# Altium project PT-15-V1.0.PrjPcb (part 1 of 7)
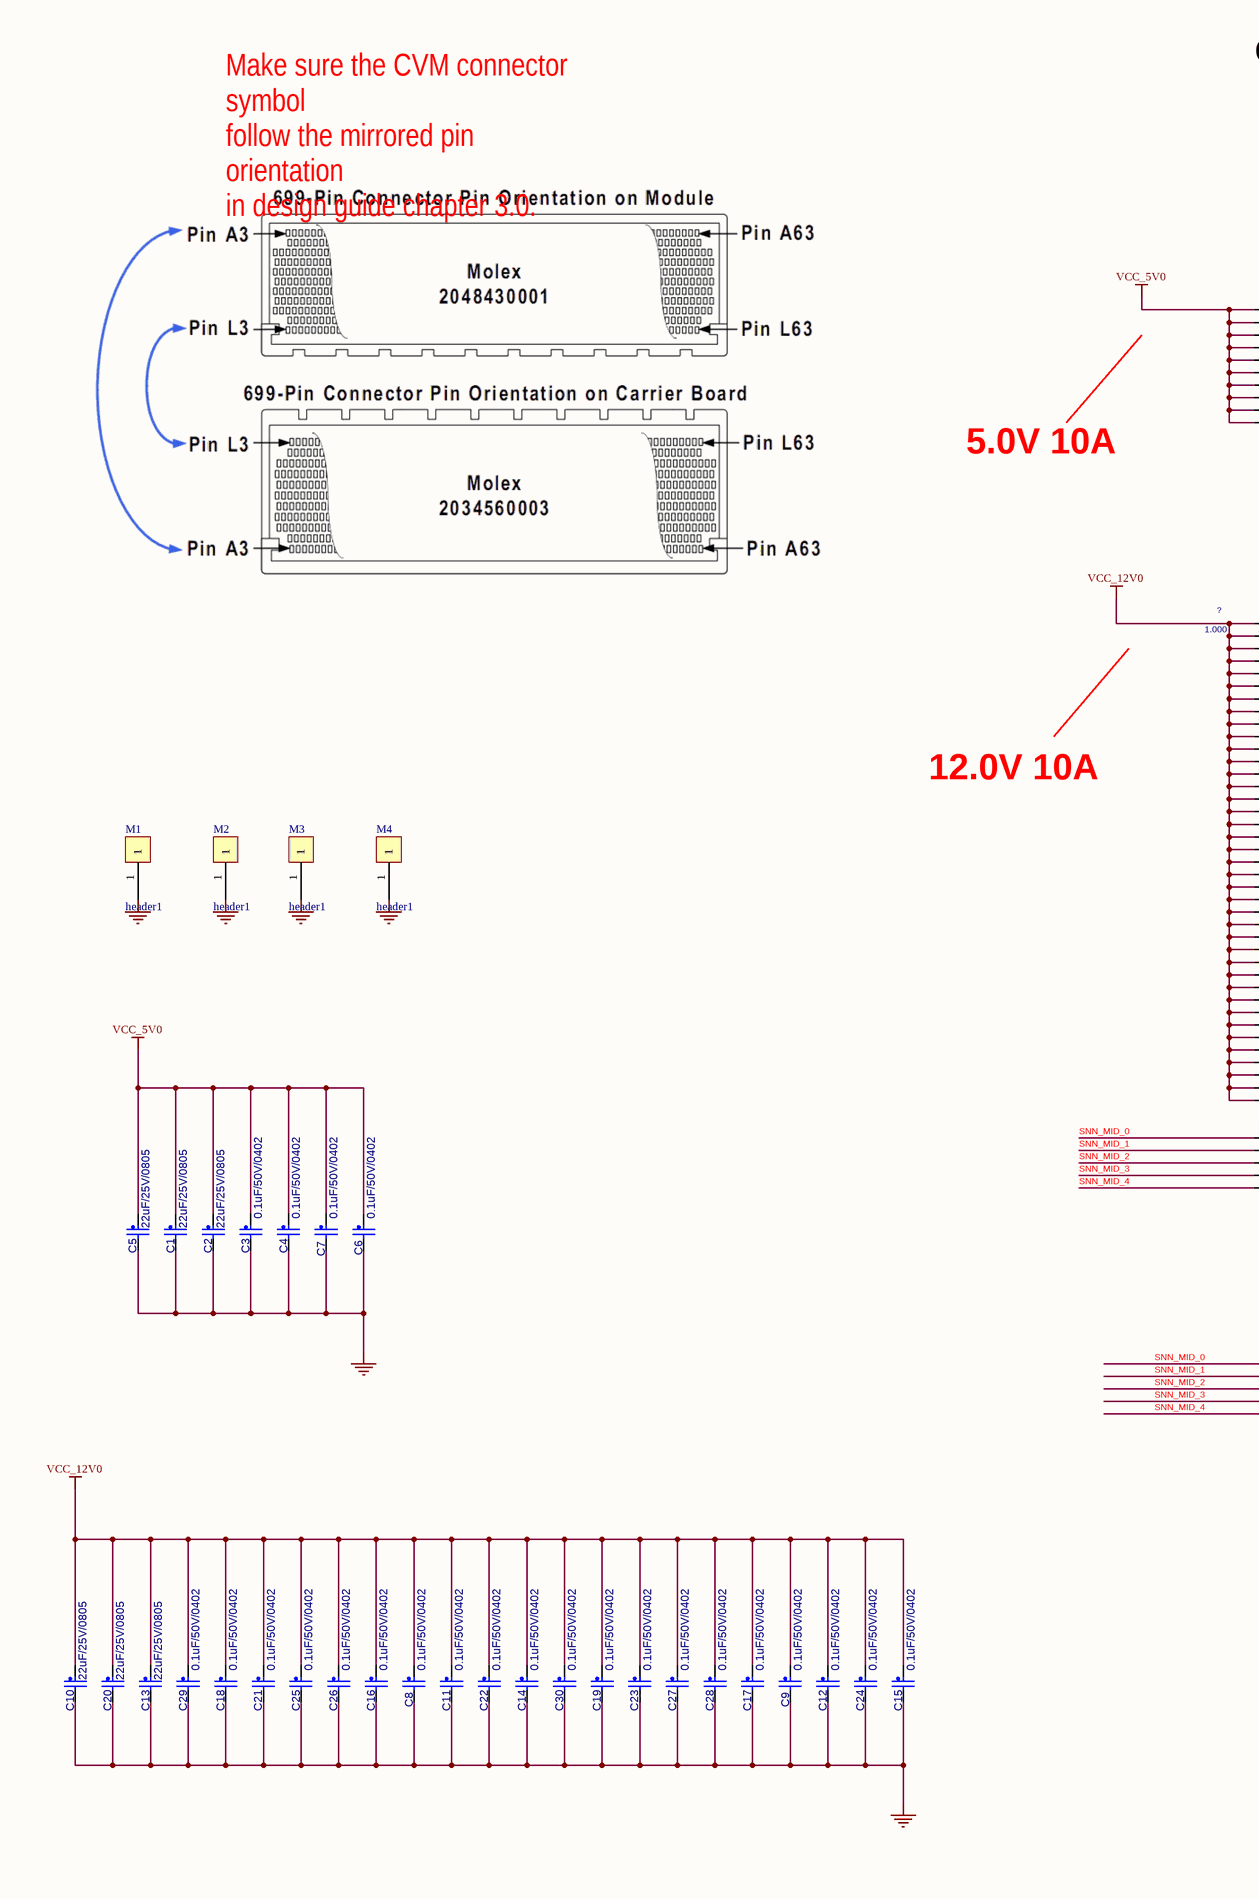
[diagram p0: 01-ORIN_PWR.SchDoc, left]
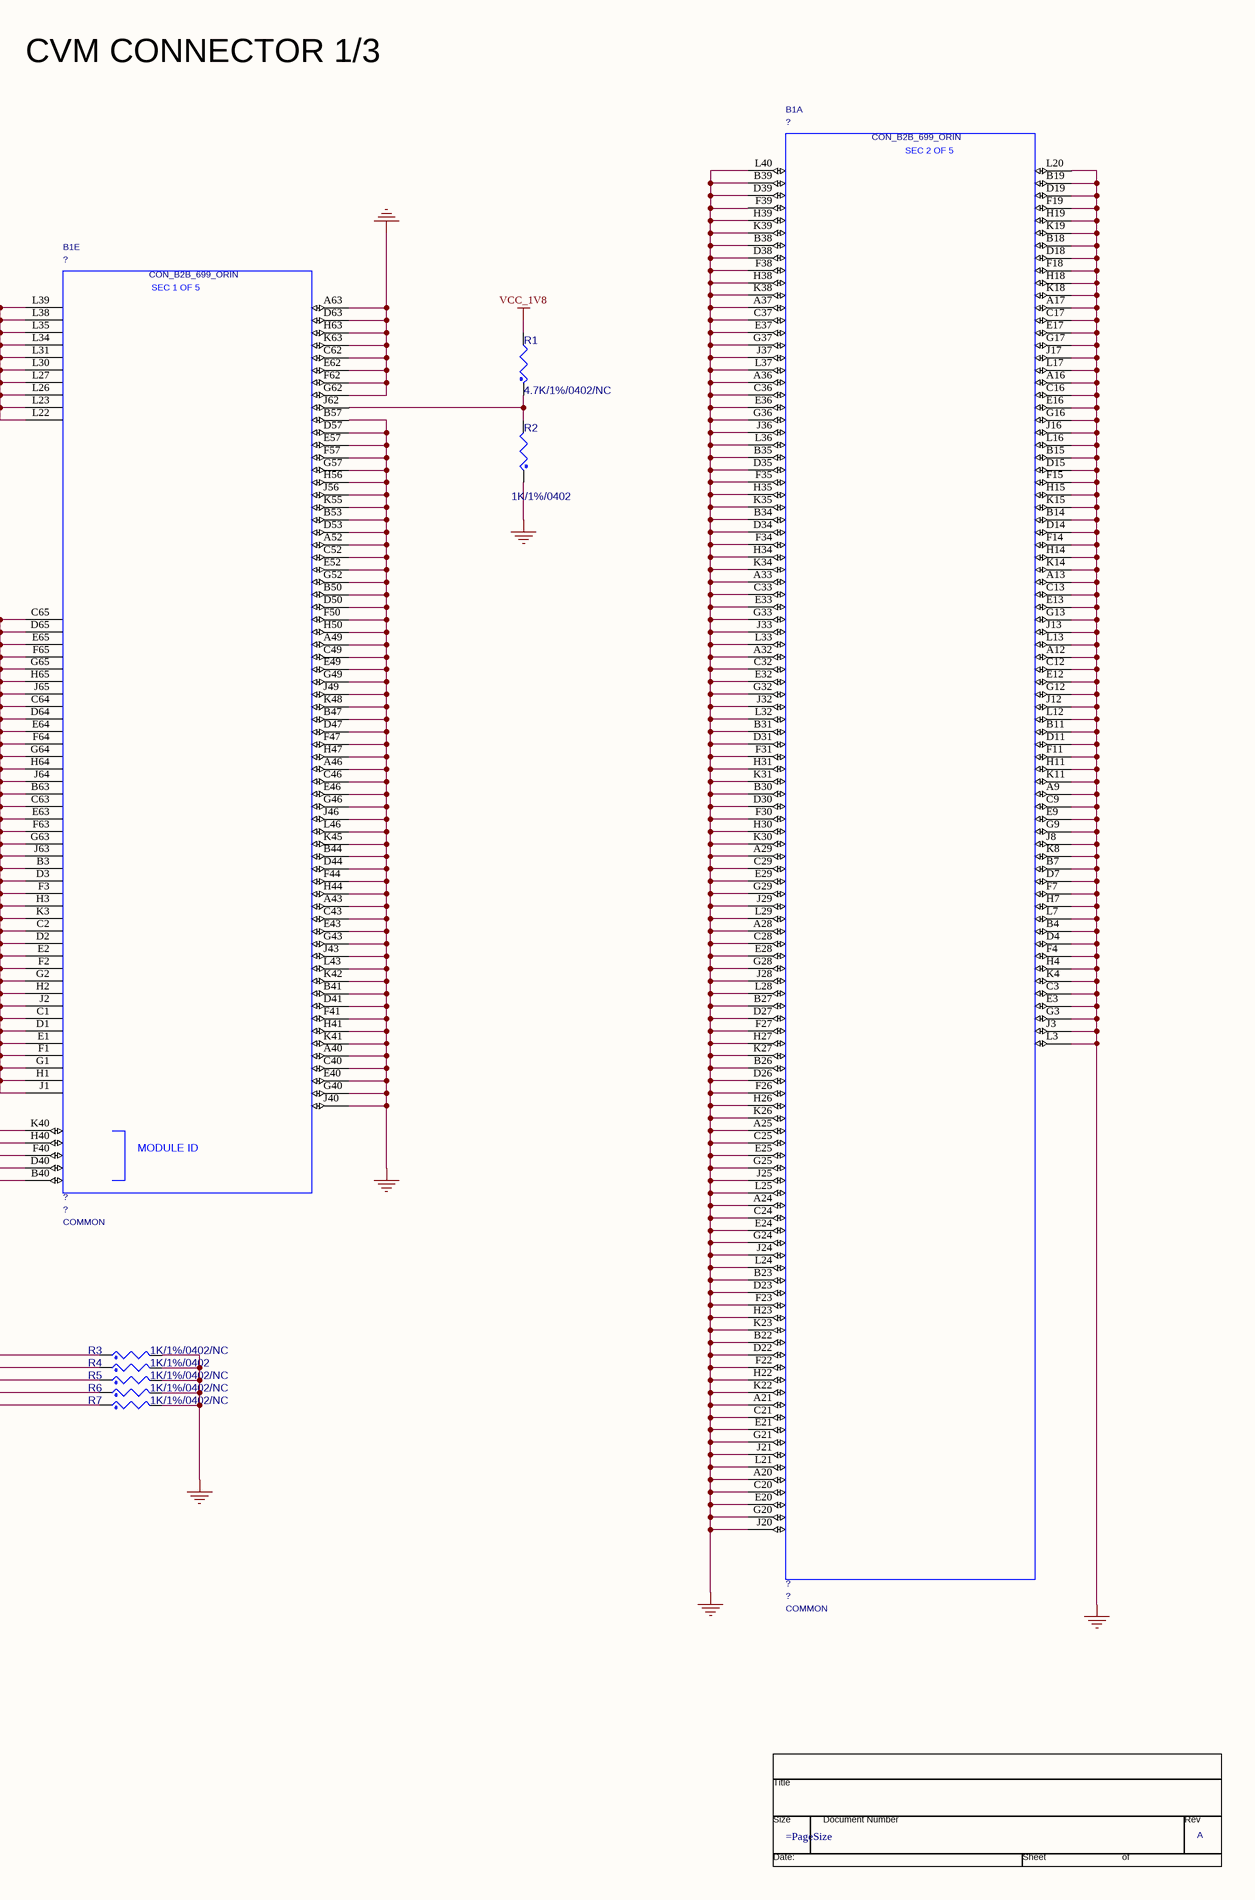
[diagram p1: 01-ORIN_PWR.SchDoc, right]
17 sheets, 1126 parts. Net scope: global (net labels, ports and power ports of the same name join across sheets).
Board file: PT-15-V1.0.PcbDoc
Sheets:
  01-ORIN_PWR.SchDoc
  02-ORIN_LOW_SPEED_SIGNAL.SchDoc
  03-ORIN_HIGH_SPEED_SIGNAL_1.SchDoc
  04-ORIN_HIGH_SPEED_SIGNAL_2.SchDoc
  05_RTL8211F.SchDoc
  06-RTL8111H-1.schdoc
  07-N100.SchDoc
  08-M2_E&M_KEY.SchDoc
  09-RTL8111H-2.schdoc
  10-ESP32.SchDoc
  11-LED.schdoc
  12-RTL8111H-3.schdoc
  13-AX88179A.SchDoc
  14-RTL8367.schdoc
  15-PWR_1.SchDoc
  16-PWR_2.SchDoc
  17-INTERFACE.SchDoc

## Sheet 01-ORIN_PWR.SchDoc: KARGOBOT-TBOX-V2.0
size 513 x 386 mm; Page Create Date: March  8, 1995; Page Number: 4; Page Size: C; Page Count: 81; RevCode: A; DsnPath: C:\Users\Administrator\Desktop\123\KARGOBOT-TCU-ORIN-V1.1.DSN; SchematicName: KARGOBT-TCU-ORIN-V1.1; PageName: 04-ORIN_PWR; PageSize: C; TopSchematic: True

### Parts
(Parts that share a designator on the sheet are numbered #1, #2 ... from top to bottom, then left to right.)
*#1  RevCode: A  (graphical)
B1  SKU: COMMON  [CON_MIRMEZ_699_BGA_ST_P009_P013_P015_REVERSE]  (hidden comment: CON_B2B_699_ORIN)  (parts A,E of 5)
C1  value 22uF/25V/0805  [C0805]  (hidden comment: CAP_NP)
C2  value 22uF/25V/0805  [C0805]  (hidden comment: CAP_NP)
C3  value 0.1uF/50V/0402  [C0402]  (hidden comment: CAP_NP)
C4  value 0.1uF/50V/0402  [C0402]  (hidden comment: CAP_NP)
C5  value 22uF/25V/0805  [C0805]  (hidden comment: CAP_NP)
C6  value 0.1uF/50V/0402  [C0402]  (hidden comment: CAP_NP)
C7  value 0.1uF/50V/0402  [C0402]  (hidden comment: CAP_NP)
C8  value 0.1uF/50V/0402  [C0402]  (hidden comment: CAP_NP)
C9  value 0.1uF/50V/0402  [C0402]  (hidden comment: CAP_NP)
C10  value 22uF/25V/0805  [C0805]  (hidden comment: CAP_NP)
C11  value 0.1uF/50V/0402  [C0402]  (hidden comment: CAP_NP)
C12  value 0.1uF/50V/0402  [C0402]  (hidden comment: CAP_NP)
C13  value 22uF/25V/0805  [C0805]  (hidden comment: CAP_NP)
C14  value 0.1uF/50V/0402  [C0402]  (hidden comment: CAP_NP)
C15  value 0.1uF/50V/0402  [C0402]  (hidden comment: CAP_NP)
C16  value 0.1uF/50V/0402  [C0402]  (hidden comment: CAP_NP)
C17  value 0.1uF/50V/0402  [C0402]  (hidden comment: CAP_NP)
C18  value 0.1uF/50V/0402  [C0402]  (hidden comment: CAP_NP)
C19  value 0.1uF/50V/0402  [C0402]  (hidden comment: CAP_NP)
C20  value 22uF/25V/0805  [C0805]  (hidden comment: CAP_NP)
C21  value 0.1uF/50V/0402  [C0402]  (hidden comment: CAP_NP)
C22  value 0.1uF/50V/0402  [C0402]  (hidden comment: CAP_NP)
C23  value 0.1uF/50V/0402  [C0402]  (hidden comment: CAP_NP)
C24  value 0.1uF/50V/0402  [C0402]  (hidden comment: CAP_NP)
C25  value 0.1uF/50V/0402  [C0402]  (hidden comment: CAP_NP)
C26  value 0.1uF/50V/0402  [C0402]  (hidden comment: CAP_NP)
C27  value 0.1uF/50V/0402  [C0402]  (hidden comment: CAP_NP)
C28  value 0.1uF/50V/0402  [C0402]  (hidden comment: CAP_NP)
C29  value 0.1uF/50V/0402  [C0402]  (hidden comment: CAP_NP)
C30  value 0.1uF/50V/0402  [C0402]  (hidden comment: CAP_NP)
M1  header1  [HOLE_M3_6.5]
M2  header1  [HOLE_M3_6.5]
M3  header1  [HOLE_M3_6.5]
M4  header1  [HOLE_M3_6.5]
R1  value 4.7K/1%/0402/NC  [R0402]  (hidden comment: RES_Dup2)
R2  value 1K/1%/0402  [R0402]  (hidden comment: RES_Dup2)
R3  value 1K/1%/0402/NC  [R0402]  (hidden comment: RES_Dup2)
R4  value 1K/1%/0402  [R0402]  (hidden comment: RES_Dup2)
R5  value 1K/1%/0402/NC  [R0402]  (hidden comment: RES_Dup2)
R6  value 1K/1%/0402/NC  [R0402]  (hidden comment: RES_Dup2)
R7  value 1K/1%/0402/NC  [R0402]  (hidden comment: RES_Dup2)

### Nets
GND: B1.A9(GND_226) B1.A12(GND_215) B1.A13(GND_209) B1.A16(GND_193) B1.A17(GND_187) B1.A20(GND_171) B1.A21(GND_165) B1.A24(GND_149) B1.A25(GND_143) B1.A28(GND_127) B1.A29(GND_121) B1.A32(GND_105) B1.A33(GND_099) B1.A36(GND_083) B1.A37(GND_077) B1.A40(GND_061) B1.A43(GND_049) B1.A46(GND_038) B1.A49(GND_028) B1.A52(GND_020) B1.A63(GND_001) B1.B4(GND_237) B1.B7(GND_232) B1.B11(GND_221) B1.B14(GND_204) B1.B15(GND_199) B1.B18(GND_182) B1.B19(GND_177) B1.B22(GND_160) B1.B23(GND_155) B1.B26(GND_138) B1.B27(GND_133) B1.B30(GND_116) B1.B31(GND_111) B1.B34(GND_094) B1.B35(GND_089) B1.B38(GND_072) B1.B39(GND_067) B1.B41(GND_056) B1.B44(GND_045) B1.B47(GND_034) B1.B50(GND_024) B1.B53(GND_018) B1.B57(GND_010) B1.C3(GND_242) B1.C9(GND_227) B1.C12(GND_216) B1.C13(GND_210) B1.C16(GND_194) B1.C17(GND_188) B1.C20(GND_172) B1.C21(GND_166) B1.C24(GND_150) B1.C25(GND_144) B1.C28(GND_128) B1.C29(GND_122) B1.C32(GND_106) B1.C33(GND_100) B1.C36(GND_084) B1.C37(GND_078) B1.C40(GND_062) B1.C43(GND_050) B1.C46(GND_039) B1.C49(GND_029) B1.C52(GND_021) B1.C62(GND_005) B1.D4(GND_238) B1.D7(GND_233) B1.D11(GND_222) B1.D14(GND_205) B1.D15(GND_200) B1.D18(GND_183) B1.D19(GND_178) B1.D22(GND_161) B1.D23(GND_156) B1.D26(GND_139) B1.D27(GND_134) B1.D30(GND_117) B1.D31(GND_112) B1.D34(GND_095) B1.D35(GND_090) B1.D38(GND_073) B1.D39(GND_068) B1.D41(GND_057) B1.D44(GND_046) B1.D47(GND_035) B1.D50(GND_025) B1.D53(GND_019) B1.D57(GND_011) B1.D63(GND_002) B1.E3(GND_243) B1.E9(GND_228) B1.E12(GND_217) B1.E13(GND_211) B1.E16(GND_195) B1.E17(GND_189) B1.E20(GND_173) B1.E21(GND_167) B1.E24(GND_151) B1.E25(GND_145) B1.E28(GND_129) B1.E29(GND_123) B1.E32(GND_107) B1.E33(GND_101) B1.E36(GND_085) B1.E37(GND_079) B1.E40(GND_063) B1.E43(GND_051) B1.E46(GND_040) B1.E49(GND_030) B1.E52(GND_022) B1.E57(GND_012) B1.E62(GND_006) B1.F4(GND_239) B1.F7(GND_234) B1.F11(GND_223) B1.F14(GND_206) B1.F15(GND_201) B1.F18(GND_184) B1.F19(GND_179) B1.F22(GND_162) B1.F23(GND_157) B1.F26(GND_140) B1.F27(GND_135) B1.F30(GND_118) B1.F31(GND_113) B1.F34(GND_096) B1.F35(GND_091) B1.F38(GND_074) B1.F39(GND_069) B1.F41(GND_058) B1.F44(GND_047) B1.F47(GND_036) B1.F50(GND_026) B1.F57(GND_013) B1.F62(GND_007) B1.G3(GND_244) B1.G9(GND_229) B1.G12(GND_218) B1.G13(GND_212) B1.G16(GND_196) B1.G17(GND_190) B1.G20(GND_174) B1.G21(GND_168) B1.G24(GND_152) B1.G25(GND_146) B1.G28(GND_130) B1.G29(GND_124) B1.G32(GND_108) B1.G33(GND_102) B1.G36(GND_086) B1.G37(GND_080) B1.G40(GND_064) B1.G43(GND_052) B1.G46(GND_041) B1.G49(GND_031) B1.G52(GND_023) B1.G57(GND_014) B1.G62(GND_008) B1.H4(GND_240) B1.H7(GND_235) B1.H11(GND_224) B1.H14(GND_207) B1.H15(GND_202) B1.H18(GND_185) B1.H19(GND_180) B1.H22(GND_163) B1.H23(GND_158) B1.H26(GND_141) B1.H27(GND_136) B1.H30(GND_119) B1.H31(GND_114) B1.H34(GND_097) B1.H35(GND_092) B1.H38(GND_075) B1.H39(GND_070) B1.H41(GND_059) B1.H44(GND_048) B1.H47(GND_037) B1.H50(GND_027) B1.H56(GND_015) B1.H63(GND_003) B1.J3(GND_245) B1.J8(GND_230) B1.J12(GND_219) B1.J13(GND_213) B1.J16(GND_197) B1.J17(GND_191) B1.J20(GND_175) B1.J21(GND_169) B1.J24(GND_153) B1.J25(GND_147) B1.J28(GND_131) B1.J29(GND_125) B1.J32(GND_109) B1.J33(GND_103) B1.J36(GND_087) B1.J37(GND_081) B1.J40(GND_065) B1.J43(GND_053) B1.J46(GND_042) B1.J49(GND_032) B1.J56(GND_016) B1.K4(GND_241) B1.K8(GND_231) B1.K11(GND_225) B1.K14(GND_208) B1.K15(GND_203) B1.K18(GND_186) B1.K19(GND_181) B1.K22(GND_164) B1.K23(GND_159) B1.K26(GND_142) B1.K27(GND_137) B1.K30(GND_120) B1.K31(GND_115) B1.K34(GND_098) B1.K35(GND_093) B1.K38(GND_076) B1.K39(GND_071) B1.K41(GND_060) B1.K42(GND_055) B1.K45(GND_044) B1.K48(GND_033) B1.K55(GND_017) B1.K63(GND_004) B1.L3(GND_246) B1.L7(GND_236) B1.L12(GND_220) B1.L13(GND_214) B1.L16(GND_198) B1.L17(GND_192) B1.L20(GND_176) B1.L21(GND_170) B1.L24(GND_154) B1.L25(GND_148) B1.L28(GND_132) B1.L29(GND_126) B1.L32(GND_110) B1.L33(GND_104) B1.L36(GND_088) B1.L37(GND_082) B1.L40(GND_066) B1.L43(GND_054) B1.L46(GND_043) C1.2 C2.2 C3.2 C4.2 C5.2 C6.2 C7.2 C8.2 C9.2 C10.2 C11.2 C12.2 C13.2 C14.2 C15.2 C16.2 C17.2 C18.2 C19.2 C20.2 C21.2 C22.2 C23.2 C24.2 C25.2 C26.2 C27.2 C28.2 C29.2 C30.2 M1.1 M2.1 M3.1 M4.1 R2.1 R3.2 R4.2 R5.2 R6.2 R7.2
VCC_1V8: R1.2  [project net 1V8_ORIN_F1]
VCC_5V0: B1.L22(SYS_VIN_MV_10) B1.L23(SYS_VIN_MV_09) B1.L26(SYS_VIN_MV_08) B1.L27(SYS_VIN_MV_07) B1.L30(SYS_VIN_MV_06) B1.L31(SYS_VIN_MV_05) B1.L34(SYS_VIN_MV_04) B1.L35(SYS_VIN_MV_03) B1.L38(SYS_VIN_MV_02) B1.L39(SYS_VIN_MV_01) C1.1 C2.1 C3.1 C4.1 C5.1 C6.1 C7.1
VCC_12V0: B1.B3(SYS_VIN_HV_21) B1.B63(SYS_VIN_HV_15) B1.C1(SYS_VIN_HV_33) B1.C2(SYS_VIN_HV_26) B1.C63(SYS_VIN_HV_16) B1.C64(SYS_VIN_HV_08) B1.C65(SYS_VIN_HV_01) B1.D1(SYS_VIN_HV_34) B1.D2(SYS_VIN_HV_27) B1.D3(SYS_VIN_HV_22) B1.D64(SYS_VIN_HV_09) B1.D65(SYS_VIN_HV_02) B1.E1(SYS_VIN_HV_35) B1.E2(SYS_VIN_HV_28) B1.E63(SYS_VIN_HV_17) B1.E64(SYS_VIN_HV_10) B1.E65(SYS_VIN_HV_03) B1.F1(SYS_VIN_HV_36) B1.F2(SYS_VIN_HV_29) B1.F3(SYS_VIN_HV_23) B1.F63(SYS_VIN_HV_18) B1.F64(SYS_VIN_HV_11) B1.F65(SYS_VIN_HV_04) B1.G1(SYS_VIN_HV_37) B1.G2(SYS_VIN_HV_30) B1.G63(SYS_VIN_HV_19) B1.G64(SYS_VIN_HV_12) B1.G65(SYS_VIN_HV_05) B1.H1(SYS_VIN_HV_38) B1.H2(SYS_VIN_HV_31) B1.H3(SYS_VIN_HV_24) B1.H64(SYS_VIN_HV_13) B1.H65(SYS_VIN_HV_06) B1.J1(SYS_VIN_HV_39) B1.J2(SYS_VIN_HV_32) B1.J63(SYS_VIN_HV_20) B1.J64(SYS_VIN_HV_14) B1.J65(SYS_VIN_HV_07) B1.K3(SYS_VIN_HV_25) C8.1 C9.1 C10.1 C11.1 C12.1 C13.1 C14.1 C15.1 C16.1 C17.1 C18.1 C19.1 C20.1 C21.1 C22.1 C23.1 C24.1 C25.1 C26.1 C27.1 C28.1 C29.1 C30.1
SNN_MID_0: B1.K40(MID0) R3.1
SNN_MID_1: B1.H40(MID1) R4.1
SNN_MID_2: B1.F40(MID2) R5.1
SNN_MID_3: B1.D40(MID3) R6.1
SNN_MID_4: B1.B40(MID4) R7.1
NetB1_J62: B1.J62(GND_009) R1.1 R2.2

### Notes on the sheet
- CVM CONNECTOR 1/3
- Make sure the CVM connector
  symbol
  follow the mirrored pin
  orientation
  in design guide chapter 3.0.
- 5.0V 10A
- 1.000
- ?
- 12.0V 10A
- (in symbol CON_B2B_699, part A) SEC 2 OF 5
- (in symbol CON_B2B_699, part E) SEC 1 OF 5; MODULE ID
- (in symbol TitleBlock0) Title; Size; Document Number; Rev; Date:; Sheet; of

### Library data of the parts
*#1 = TitleBlock0: Title: KARGOBOT-TBOX-V2.0; Page Number: 4; Page Count: 81; Page Create Date: March  8, 1995; Page Size: =PageSize; Page Modify Date: =ModifiedDate
B1 = CON_B2B_699: 2034560003/MOLEX; Part Reference: B1; OriginalSymbolOrigin: (-500,1750); ASSEMBLY: ?; DEVICE: CON_B2B_699_ORIN; NV_PN: ?; PACK_TYPE: ?; PATH: ?; PLACEMENT_NOTE: ?; Value: CON_B2B_699_ORIN; PCB Footprint: CON_MIRMEZ_699_BGA_ST_P009_P013_P015_REVERSE
C1 = CAP_NP: GRT31CC71E226ME13/MURATA; Part Reference: C6; CLASS: DISCRETE; FPLIST: CC0603_OV,CC0603,0603_CC; Tolerance: 10%; AGILE_PN: 150-78675; MFG_NAME01: TDK; MFG_PN01: C1608X5R1A106K; CAD_APPROVED: Yes; VOLTAGE: 10v; PCB Footprint: C1206; TOL: 10%; ROHS: Yes; HEIGHT: 1.016MM
C2 = CAP_NP: GRT31CC71E226ME13/MURATA; Part Reference: C7; CLASS: DISCRETE; VOLTAGE: 10v; CAD_APPROVED: Yes; MFG_PN01: C1608X5R1A106K; MFG_NAME01: TDK; TOL: 10%; AGILE_PN: 150-78675; FPLIST: CC0603_OV,CC0603,0603_CC; PCB Footprint: C1206; HEIGHT: 1.016MM; ROHS: Yes; Tolerance: 10%
C3 = CAP_NP: GCM155R71H104KE02/MURATA; Part Reference: C8; CLASS: DISCRETE; TOL: 10%; VOLTAGE: 16V; AGILE_PN: 150-75182; MFG_NAME01: AVX; MFG_PN01: 0402YC104KAT2A; CAD_APPROVED: Yes; FPLIST: CC0402_25,CC0402_HD,CC0402_CC; Tolerance: 10%; ROHS: Yes; HEIGHT: 0.635MM; PCB Footprint: C0402
C4 = CAP_NP: GCM155R71H104KE02/MURATA; Part Reference: C9; CLASS: DISCRETE; FPLIST: CC0402_25,CC0402_HD,CC0402_CC; CAD_APPROVED: Yes; MFG_PN01: 0402YC104KAT2A; MFG_NAME01: AVX; Tolerance: 10%; AGILE_PN: 150-75182; VOLTAGE: 16V; HEIGHT: 0.635MM; ROHS: Yes; TOL: 10%; PCB Footprint: C0402
C5 = CAP_NP: GRT31CC71E226ME13/MURATA; Part Reference: C5; CLASS: DISCRETE; FPLIST: CC0603_OV,CC0603,0603_CC; Tolerance: 10%; AGILE_PN: 150-78675; MFG_NAME01: TDK; MFG_PN01: C1608X5R1A106K; CAD_APPROVED: Yes; VOLTAGE: 10v; PCB Footprint: C1206; TOL: 10%; ROHS: Yes; HEIGHT: 1.016MM
C6 = CAP_NP: GCM155R71H104KE02/MURATA; Part Reference: C11; CLASS: DISCRETE; FPLIST: CC0402_25,CC0402_HD,CC0402_CC; CAD_APPROVED: Yes; MFG_PN01: 0402YC104KAT2A; MFG_NAME01: AVX; Tolerance: 10%; AGILE_PN: 150-75182; VOLTAGE: 16V; HEIGHT: 0.635MM; ROHS: Yes; TOL: 10%; PCB Footprint: C0402
C7 = CAP_NP: GCM155R71H104KE02/MURATA; Part Reference: C10; CLASS: DISCRETE; TOL: 10%; VOLTAGE: 16V; AGILE_PN: 150-75182; MFG_NAME01: AVX; MFG_PN01: 0402YC104KAT2A; CAD_APPROVED: Yes; FPLIST: CC0402_25,CC0402_HD,CC0402_CC; Tolerance: 10%; ROHS: Yes; HEIGHT: 0.635MM; PCB Footprint: C0402
C8 = CAP_NP: GCM155R71H104KE02/MURATA; Part Reference: C21; CLASS: DISCRETE; FPLIST: CC0402_25,CC0402_HD,CC0402_CC; CAD_APPROVED: Yes; MFG_PN01: 0402YC104KAT2A; MFG_NAME01: AVX; Tolerance: 10%; AGILE_PN: 150-75182; VOLTAGE: 16V; HEIGHT: 0.635MM; ROHS: Yes; TOL: 10%; PCB Footprint: C0402
C9 = CAP_NP: GCM155R71H104KE02/MURATA; Part Reference: C31; CLASS: DISCRETE; FPLIST: CC0402_25,CC0402_HD,CC0402_CC; CAD_APPROVED: Yes; MFG_PN01: 0402YC104KAT2A; MFG_NAME01: AVX; Tolerance: 10%; AGILE_PN: 150-75182; VOLTAGE: 16V; HEIGHT: 0.635MM; ROHS: Yes; TOL: 10%; PCB Footprint: C0402
C10 = CAP_NP: GRT31CC71E226ME13/MURATA; Part Reference: C12; CLASS: DISCRETE; VOLTAGE: 10v; CAD_APPROVED: Yes; MFG_PN01: C1608X5R1A106K; MFG_NAME01: TDK; TOL: 10%; AGILE_PN: 150-78675; FPLIST: CC0603_OV,CC0603,0603_CC; PCB Footprint: C1206; HEIGHT: 1.016MM; ROHS: Yes; Tolerance: 10%
C11 = CAP_NP: GCM155R71H104KE02/MURATA; Part Reference: C22; CLASS: DISCRETE; TOL: 10%; VOLTAGE: 16V; AGILE_PN: 150-75182; MFG_NAME01: AVX; MFG_PN01: 0402YC104KAT2A; CAD_APPROVED: Yes; FPLIST: CC0402_25,CC0402_HD,CC0402_CC; Tolerance: 10%; ROHS: Yes; HEIGHT: 0.635MM; PCB Footprint: C0402
C12 = CAP_NP: GCM155R71H104KE02/MURATA; Part Reference: C32; CLASS: DISCRETE; TOL: 10%; VOLTAGE: 16V; AGILE_PN: 150-75182; MFG_NAME01: AVX; MFG_PN01: 0402YC104KAT2A; CAD_APPROVED: Yes; FPLIST: CC0402_25,CC0402_HD,CC0402_CC; Tolerance: 10%; ROHS: Yes; HEIGHT: 0.635MM; PCB Footprint: C0402
C13 = CAP_NP: GRT31CC71E226ME13/MURATA; Part Reference: C14; CLASS: DISCRETE; FPLIST: CC0603_OV,CC0603,0603_CC; Tolerance: 10%; AGILE_PN: 150-78675; MFG_NAME01: TDK; MFG_PN01: C1608X5R1A106K; CAD_APPROVED: Yes; VOLTAGE: 10v; PCB Footprint: C1206; TOL: 10%; ROHS: Yes; HEIGHT: 1.016MM
C14 = CAP_NP: GCM155R71H104KE02/MURATA; Part Reference: C24; CLASS: DISCRETE; TOL: 10%; VOLTAGE: 16V; AGILE_PN: 150-75182; MFG_NAME01: AVX; MFG_PN01: 0402YC104KAT2A; CAD_APPROVED: Yes; FPLIST: CC0402_25,CC0402_HD,CC0402_CC; Tolerance: 10%; ROHS: Yes; HEIGHT: 0.635MM; PCB Footprint: C0402
C15 = CAP_NP: GCM155R71H104KE02/MURATA; Part Reference: C34; CLASS: DISCRETE; TOL: 10%; VOLTAGE: 16V; AGILE_PN: 150-75182; MFG_NAME01: AVX; MFG_PN01: 0402YC104KAT2A; CAD_APPROVED: Yes; FPLIST: CC0402_25,CC0402_HD,CC0402_CC; Tolerance: 10%; ROHS: Yes; HEIGHT: 0.635MM; PCB Footprint: C0402
C16 = CAP_NP: GCM155R71H104KE02/MURATA; Part Reference: C20; CLASS: DISCRETE; TOL: 10%; VOLTAGE: 16V; AGILE_PN: 150-75182; MFG_NAME01: AVX; MFG_PN01: 0402YC104KAT2A; CAD_APPROVED: Yes; FPLIST: CC0402_25,CC0402_HD,CC0402_CC; Tolerance: 10%; ROHS: Yes; HEIGHT: 0.635MM; PCB Footprint: C0402
C17 = CAP_NP: GCM155R71H104KE02/MURATA; Part Reference: C30; CLASS: DISCRETE; TOL: 10%; VOLTAGE: 16V; AGILE_PN: 150-75182; MFG_NAME01: AVX; MFG_PN01: 0402YC104KAT2A; CAD_APPROVED: Yes; FPLIST: CC0402_25,CC0402_HD,CC0402_CC; Tolerance: 10%; ROHS: Yes; HEIGHT: 0.635MM; PCB Footprint: C0402
C18 = CAP_NP: GCM155R71H104KE02/MURATA; Part Reference: C16; CLASS: DISCRETE; TOL: 10%; VOLTAGE: 16V; AGILE_PN: 150-75182; MFG_NAME01: AVX; MFG_PN01: 0402YC104KAT2A; CAD_APPROVED: Yes; FPLIST: CC0402_25,CC0402_HD,CC0402_CC; Tolerance: 10%; ROHS: Yes; HEIGHT: 0.635MM; PCB Footprint: C0402
C19 = CAP_NP: GCM155R71H104KE02/MURATA; Part Reference: C26; CLASS: DISCRETE; TOL: 10%; VOLTAGE: 16V; AGILE_PN: 150-75182; MFG_NAME01: AVX; MFG_PN01: 0402YC104KAT2A; CAD_APPROVED: Yes; FPLIST: CC0402_25,CC0402_HD,CC0402_CC; Tolerance: 10%; ROHS: Yes; HEIGHT: 0.635MM; PCB Footprint: C0402
C20 = CAP_NP: GRT31CC71E226ME13/MURATA; Part Reference: C13; CLASS: DISCRETE; VOLTAGE: 10v; CAD_APPROVED: Yes; MFG_PN01: C1608X5R1A106K; MFG_NAME01: TDK; TOL: 10%; AGILE_PN: 150-78675; FPLIST: CC0603_OV,CC0603,0603_CC; PCB Footprint: C1206; HEIGHT: 1.016MM; ROHS: Yes; Tolerance: 10%
C21 = CAP_NP: GCM155R71H104KE02/MURATA; Part Reference: C17; CLASS: DISCRETE; FPLIST: CC0402_25,CC0402_HD,CC0402_CC; CAD_APPROVED: Yes; MFG_PN01: 0402YC104KAT2A; MFG_NAME01: AVX; Tolerance: 10%; AGILE_PN: 150-75182; VOLTAGE: 16V; HEIGHT: 0.635MM; ROHS: Yes; TOL: 10%; PCB Footprint: C0402
C22 = CAP_NP: GCM155R71H104KE02/MURATA; Part Reference: C23; CLASS: DISCRETE; FPLIST: CC0402_25,CC0402_HD,CC0402_CC; CAD_APPROVED: Yes; MFG_PN01: 0402YC104KAT2A; MFG_NAME01: AVX; Tolerance: 10%; AGILE_PN: 150-75182; VOLTAGE: 16V; HEIGHT: 0.635MM; ROHS: Yes; TOL: 10%; PCB Footprint: C0402
C23 = CAP_NP: GCM155R71H104KE02/MURATA; Part Reference: C27; CLASS: DISCRETE; FPLIST: CC0402_25,CC0402_HD,CC0402_CC; CAD_APPROVED: Yes; MFG_PN01: 0402YC104KAT2A; MFG_NAME01: AVX; Tolerance: 10%; AGILE_PN: 150-75182; VOLTAGE: 16V; HEIGHT: 0.635MM; ROHS: Yes; TOL: 10%; PCB Footprint: C0402
C24 = CAP_NP: GCM155R71H104KE02/MURATA; Part Reference: C33; CLASS: DISCRETE; FPLIST: CC0402_25,CC0402_HD,CC0402_CC; CAD_APPROVED: Yes; MFG_PN01: 0402YC104KAT2A; MFG_NAME01: AVX; Tolerance: 10%; AGILE_PN: 150-75182; VOLTAGE: 16V; HEIGHT: 0.635MM; ROHS: Yes; TOL: 10%; PCB Footprint: C0402
C25 = CAP_NP: GCM155R71H104KE02/MURATA; Part Reference: C18; CLASS: DISCRETE; TOL: 10%; VOLTAGE: 16V; AGILE_PN: 150-75182; MFG_NAME01: AVX; MFG_PN01: 0402YC104KAT2A; CAD_APPROVED: Yes; FPLIST: CC0402_25,CC0402_HD,CC0402_CC; Tolerance: 10%; ROHS: Yes; HEIGHT: 0.635MM; PCB Footprint: C0402
C26 = CAP_NP: GCM155R71H104KE02/MURATA; Part Reference: C19; CLASS: DISCRETE; FPLIST: CC0402_25,CC0402_HD,CC0402_CC; CAD_APPROVED: Yes; MFG_PN01: 0402YC104KAT2A; MFG_NAME01: AVX; Tolerance: 10%; AGILE_PN: 150-75182; VOLTAGE: 16V; HEIGHT: 0.635MM; ROHS: Yes; TOL: 10%; PCB Footprint: C0402
C27 = CAP_NP: GCM155R71H104KE02/MURATA; Part Reference: C28; CLASS: DISCRETE; TOL: 10%; VOLTAGE: 16V; AGILE_PN: 150-75182; MFG_NAME01: AVX; MFG_PN01: 0402YC104KAT2A; CAD_APPROVED: Yes; FPLIST: CC0402_25,CC0402_HD,CC0402_CC; Tolerance: 10%; ROHS: Yes; HEIGHT: 0.635MM; PCB Footprint: C0402
C28 = CAP_NP: GCM155R71H104KE02/MURATA; Part Reference: C29; CLASS: DISCRETE; FPLIST: CC0402_25,CC0402_HD,CC0402_CC; CAD_APPROVED: Yes; MFG_PN01: 0402YC104KAT2A; MFG_NAME01: AVX; Tolerance: 10%; AGILE_PN: 150-75182; VOLTAGE: 16V; HEIGHT: 0.635MM; ROHS: Yes; TOL: 10%; PCB Footprint: C0402
C29 = CAP_NP: GCM155R71H104KE02/MURATA; Part Reference: C15; CLASS: DISCRETE; FPLIST: CC0402_25,CC0402_HD,CC0402_CC; CAD_APPROVED: Yes; MFG_PN01: 0402YC104KAT2A; MFG_NAME01: AVX; Tolerance: 10%; AGILE_PN: 150-75182; VOLTAGE: 16V; HEIGHT: 0.635MM; ROHS: Yes; TOL: 10%; PCB Footprint: C0402
C30 = CAP_NP: GCM155R71H104KE02/MURATA; Part Reference: C25; CLASS: DISCRETE; FPLIST: CC0402_25,CC0402_HD,CC0402_CC; CAD_APPROVED: Yes; MFG_PN01: 0402YC104KAT2A; MFG_NAME01: AVX; Tolerance: 10%; AGILE_PN: 150-75182; VOLTAGE: 16V; HEIGHT: 0.635MM; ROHS: Yes; TOL: 10%; PCB Footprint: C0402
R1 = RES_Dup2: AC0402FR-074K7L/YAGEO; Part Reference: R1; CLASS: DISCRETE; TOL: 5%; AGILE_PN: 470-75626; MFG_NAME01: KOA SPEER; MFG_PN01: RK73B1ETTP472J; CAD_APPROVED: Yes; FPLIST: RC0402_25,RC0402_HD,RC0402_CC; HEIGHT: 0.41mm; Tolerance: 5%; ROHS: Yes; PCB Footprint: R0402
R2 = RES_Dup2: AC0402FR-071KL/YAGEO; Part Reference: R2; CLASS: DISCRETE; SIGNAL_MODEL: DEFAULT_RESISTOR_33.000000OHM_2_1; FPLIST: RC0603_OV; CAD_APPROVED: Yes; MFG_PN01: CR-02FL6---33R; MFG_NAME01: YAGEO; Tolerance: 1%; AGILE_PN: 470-75790; TOL: 5%; ROHS: Yes; HEIGHT: 0.4MM; PCB Footprint: R0402
R3 = RES_Dup2: AC0402FR-071KL/YAGEO; Part Reference: R7; CLASS: DISCRETE; TOL: 5%; AGILE_PN: 470-75790; Tolerance: 1%; MFG_NAME01: YAGEO; MFG_PN01: CR-02FL6---33R; CAD_APPROVED: Yes; FPLIST: RC0603_OV; SIGNAL_MODEL: DEFAULT_RESISTOR_33.000000OHM_2_1; HEIGHT: 0.4MM; ROHS: Yes; PCB Footprint: R0402
R4 = RES_Dup2: AC0402FR-071KL/YAGEO; Part Reference: R8; CLASS: DISCRETE; SIGNAL_MODEL: DEFAULT_RESISTOR_33.000000OHM_2_1; FPLIST: RC0603_OV; CAD_APPROVED: Yes; MFG_PN01: CR-02FL6---33R; MFG_NAME01: YAGEO; Tolerance: 1%; AGILE_PN: 470-75790; TOL: 5%; ROHS: Yes; HEIGHT: 0.4MM; PCB Footprint: R0402
R5 = RES_Dup2: AC0402FR-071KL/YAGEO; Part Reference: R9; CLASS: DISCRETE; TOL: 5%; AGILE_PN: 470-75790; Tolerance: 1%; MFG_NAME01: YAGEO; MFG_PN01: CR-02FL6---33R; CAD_APPROVED: Yes; FPLIST: RC0603_OV; SIGNAL_MODEL: DEFAULT_RESISTOR_33.000000OHM_2_1; HEIGHT: 0.4MM; ROHS: Yes; PCB Footprint: R0402
R6 = RES_Dup2: AC0402FR-071KL/YAGEO; Part Reference: R10; CLASS: DISCRETE; TOL: 5%; AGILE_PN: 470-75790; Tolerance: 1%; MFG_NAME01: YAGEO; MFG_PN01: CR-02FL6---33R; CAD_APPROVED: Yes; FPLIST: RC0603_OV; SIGNAL_MODEL: DEFAULT_RESISTOR_33.000000OHM_2_1; HEIGHT: 0.4MM; ROHS: Yes; PCB Footprint: R0402
R7 = RES_Dup2: AC0402FR-071KL/YAGEO; Part Reference: R11; CLASS: DISCRETE; TOL: 5%; AGILE_PN: 470-75790; Tolerance: 1%; MFG_NAME01: YAGEO; MFG_PN01: CR-02FL6---33R; CAD_APPROVED: Yes; FPLIST: RC0603_OV; SIGNAL_MODEL: DEFAULT_RESISTOR_33.000000OHM_2_1; HEIGHT: 0.4MM; ROHS: Yes; PCB Footprint: R0402